# EAGLE schematic resistor-board (EAGLE 6.4)
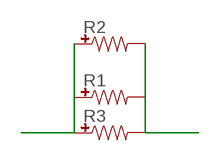
[diagram p0: schematic, sheet 1]

## Parts
R1  RESISTORUNIVERSAL  [0402-0603-0805-UNIVERSAL]
R2  RESISTORAXIAL-0.3  [AXIAL-0.3]
R3  RESISTOR1206  [1206]

## Nets
N$1: R1.- R2.P$2 R3.2
N$2: R1.+ R2.P$1 R3.1

## Library data of the parts
R1-R3 = tekdemo:RESISTOR: Resistor Basic schematic elements and footprints for 0603, 1206, and PTH resistors.